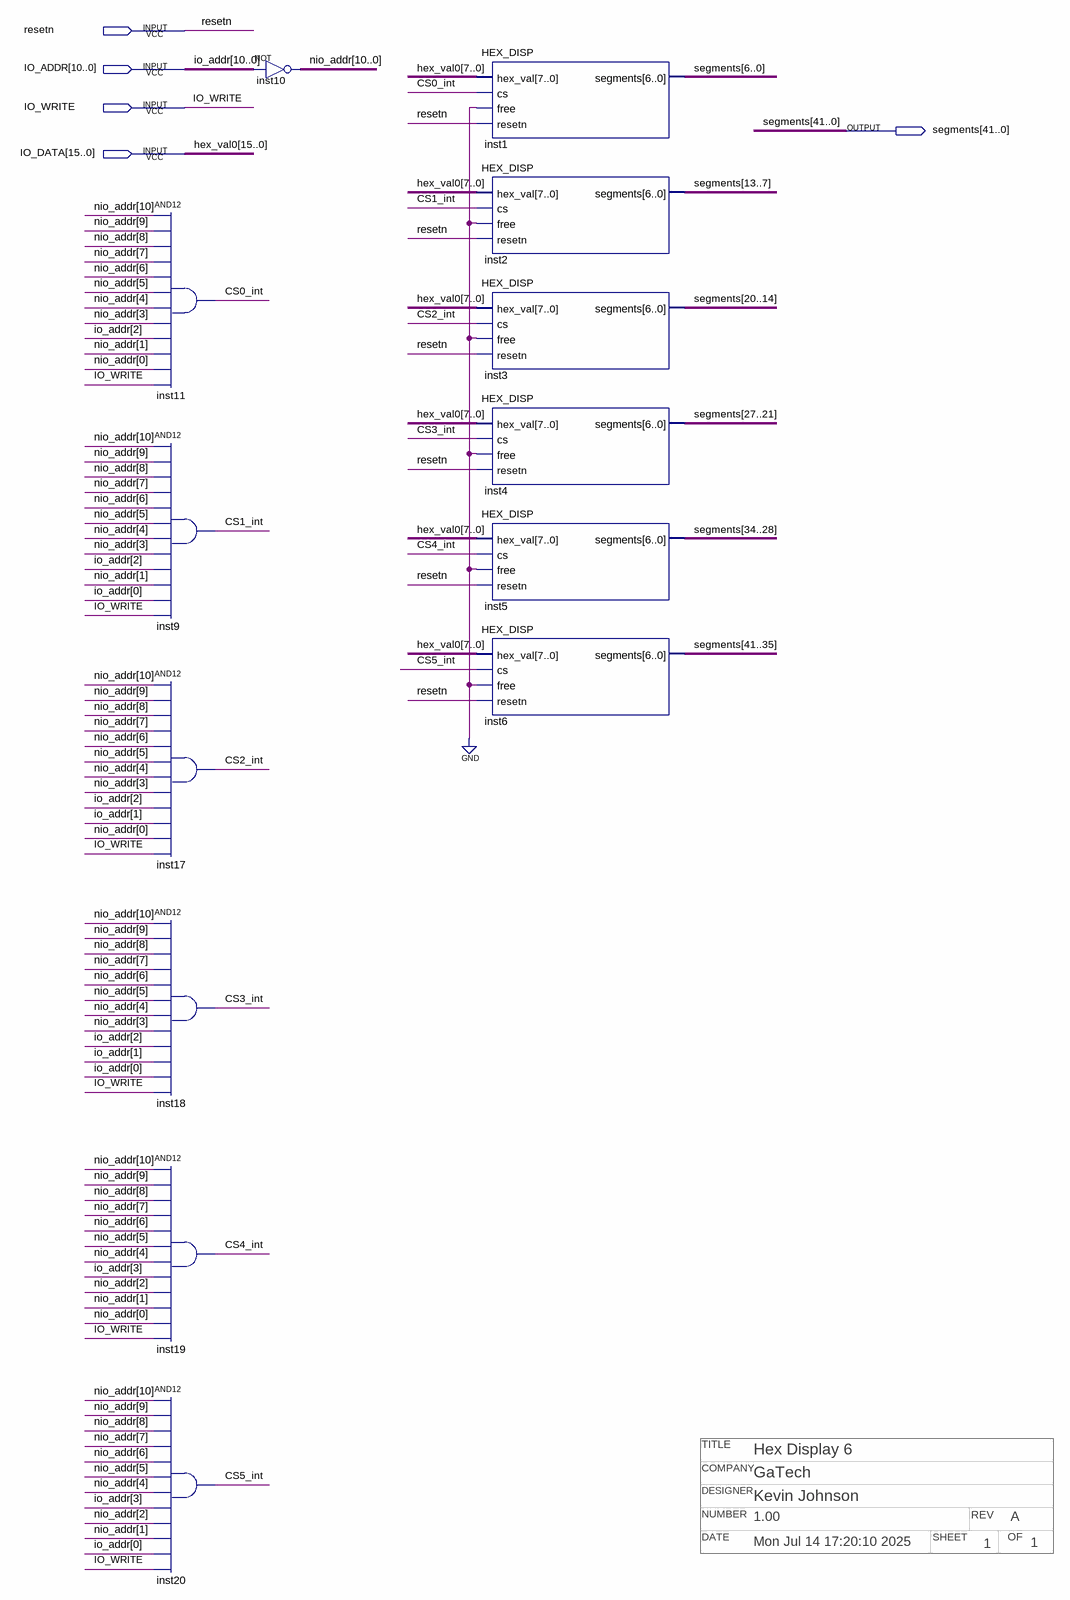
[diagram p0: schematic sheet]
// Quartus schematic HEX_DISP_6.bdf as structural Verilog: 13 symbols, 5 pins
// Title block: TITLE: Hex Display 6; COMPANY: GaTech; DESIGNER: Kevin Johnson; NUMBER: 1.00; REV: A; DATE: Mon Jul 14 17:20:10 2025; SHEET: 1; OF: 1
module HEX_DISP_6 (
  input  resetn,
  input  [10:0] IO_ADDR,
  input  IO_WRITE,
  input  [15:0] IO_DATA,
  output [41:0] segments
);

  wire CS0_int, CS1_int, CS2_int, CS3_int, CS4_int, CS5_int;
  wire [10:0] nio_addr;

  and inst11 (CS0_int, nio_addr[10], nio_addr[9], nio_addr[8], nio_addr[7], nio_addr[6], nio_addr[5], nio_addr[4], nio_addr[3], IO_ADDR[2], nio_addr[1], nio_addr[0], IO_WRITE);
  and inst9 (CS1_int, nio_addr[10], nio_addr[9], nio_addr[8], nio_addr[7], nio_addr[6], nio_addr[5], nio_addr[4], nio_addr[3], IO_ADDR[2], nio_addr[1], IO_ADDR[0], IO_WRITE);
  and inst17 (CS2_int, nio_addr[10], nio_addr[9], nio_addr[8], nio_addr[7], nio_addr[6], nio_addr[5], nio_addr[4], nio_addr[3], IO_ADDR[2], IO_ADDR[1], nio_addr[0], IO_WRITE);
  and inst18 (CS3_int, nio_addr[10], nio_addr[9], nio_addr[8], nio_addr[7], nio_addr[6], nio_addr[5], nio_addr[4], nio_addr[3], IO_ADDR[2], IO_ADDR[1], IO_ADDR[0], IO_WRITE);
  and inst19 (CS4_int, nio_addr[10], nio_addr[9], nio_addr[8], nio_addr[7], nio_addr[6], nio_addr[5], nio_addr[4], IO_ADDR[3], nio_addr[2], nio_addr[1], nio_addr[0], IO_WRITE);
  and inst20 (CS5_int, nio_addr[10], nio_addr[9], nio_addr[8], nio_addr[7], nio_addr[6], nio_addr[5], nio_addr[4], IO_ADDR[3], nio_addr[2], nio_addr[1], IO_ADDR[0], IO_WRITE);
  assign nio_addr = ~IO_ADDR;  // NOT inst10, 11 bits wide
  HEX_DISP inst1 (.hex_val(IO_DATA[7:0]), .cs(CS0_int), .free(1'b0), .resetn(resetn), .segments(segments[6:0]));
  HEX_DISP inst2 (.hex_val(IO_DATA[7:0]), .cs(CS1_int), .free(1'b0), .resetn(resetn), .segments(segments[13:7]));
  HEX_DISP inst3 (.hex_val(IO_DATA[7:0]), .cs(CS2_int), .free(1'b0), .resetn(resetn), .segments(segments[20:14]));
  HEX_DISP inst4 (.hex_val(IO_DATA[7:0]), .cs(CS3_int), .free(1'b0), .resetn(resetn), .segments(segments[27:21]));
  HEX_DISP inst5 (.hex_val(IO_DATA[7:0]), .cs(CS4_int), .free(1'b0), .resetn(resetn), .segments(segments[34:28]));
  HEX_DISP inst6 (.hex_val(IO_DATA[7:0]), .cs(CS5_int), .free(1'b0), .resetn(resetn), .segments(segments[41:35]));

  // Other names for the same wires on the sheet: hex_val0[15:0] = IO_DATA
endmodule
